# Altium schematic sheet S7CAS-PLEIADES-CARTE-MERE_Pxx_ARBRE_CAP_ARBRE.SchDoc
size Tabloid; SheetNumber: 16; SheetTotal: 18; Sheet_Name: POWER TREE DECOUPLING; Size: 11x17
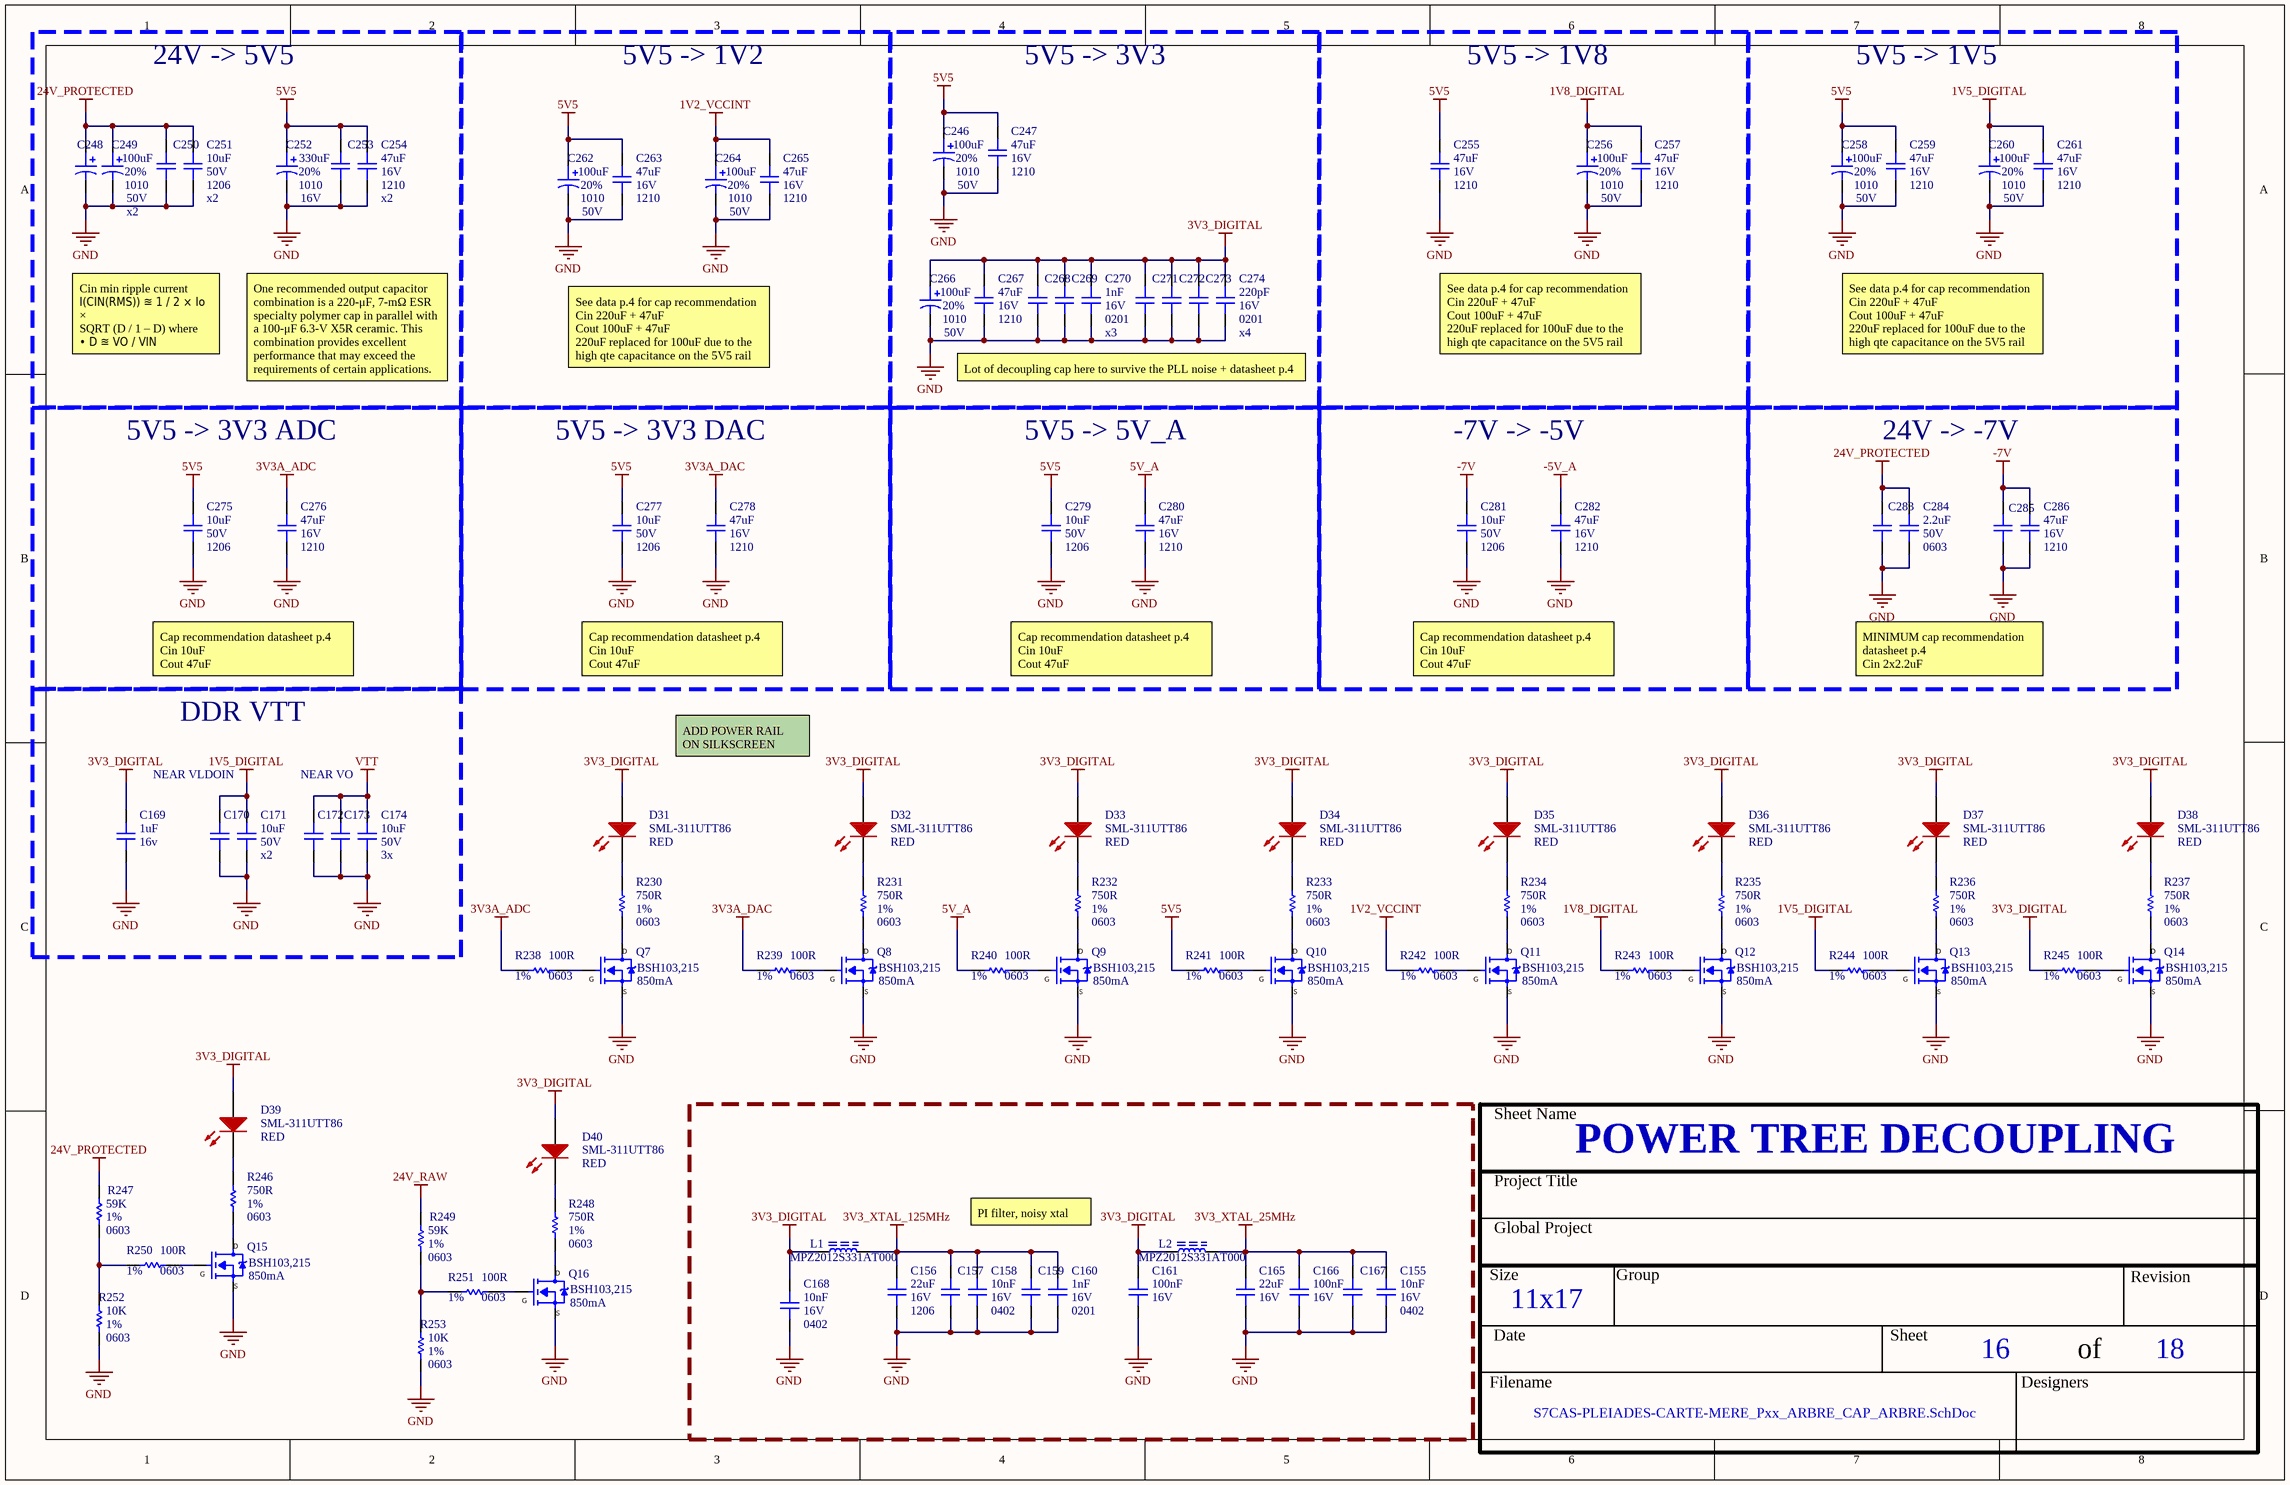
[diagram p0: S7CAS-PLEIADES-CARTE-MERE_Pxx_ARBRE_CAP_ARBRE.SchDoc]

## Parts
C155  value 10nF  Voltage: 16V  Package: 0402  [CAP_0402]  (hidden comment: CAP - 0402)
C156  value 22uF  Voltage: 16V  Package: 1206  [CAP_1206]  (hidden comment: CAP - 1206)
C157  CAP - 0402  [CAP_0402]  (value not drawn)
C158  value 10nF  Voltage: 16V  Package: 0402  [CAP_0402]  (hidden comment: CAP - 0402)
C159  CAP - 0201  [CAP_0201]  (value not drawn)
C160  value 1nF  Voltage: 16V  Package: 0201  [CAP_0201]  (hidden comment: CAP - 0201)
C161  value 100nF  Voltage: 16V  [CAP_0603]  (hidden comment: CAP - 0603)
C165  value 22uF  Voltage: 16V  [CAP_1206]  (hidden comment: CAP - 1206)
C166  value 100nF  Voltage: 16V  [CAP_0603]  (hidden comment: CAP - 0603)
C167  CAP - 0402  [CAP_0402]  (value not drawn)
C168  value 10nF  Voltage: 16V  Package: 0402  [CAP_0402]  (hidden comment: CAP - 0402)
C169  value 1uF  Voltage: 16v  [CAP_0603]  (hidden comment: CAP - 0603)
C170  CAP - 0805  [CAP_0805]  (value not drawn)
C171  value 10uF  Voltage: 50V  [CAP_0805]  (hidden comment: CAP - 0805)
C172  CAP - 0805  [CAP_0805]  (value not drawn)
C173  CAP - 0805  [CAP_0805]  (value not drawn)
C174  value 10uF  Voltage: 50V  [CAP_0805]  (hidden comment: CAP - 0805)
C246  value 100uF  Voltage: 50V  Package: 1010  Precision: 20%  [CAP_ALU_1010_vishay]  (hidden comment: MAL215099101E3)
C247  value 47uF  Voltage: 16V  Package: 1210  [CAP_1210]  (hidden comment: CAP - 1210)
C248  MAL215099101E3  [CAP_ALU_1010_vishay]  (value not drawn)
C249  value 100uF  Voltage: 50V  Package: 1010  Precision: 20%  [CAP_ALU_1010_vishay]  (hidden comment: MAL215099101E3)
C250  CAP - 1206  [CAP_1206]  (value not drawn)
C251  value 10uF  Voltage: 50V  Package: 1206  [CAP_1206]  (hidden comment: CAP - 1206)
C252  value 330uF  Voltage: 16V  Package: 1010  Precision: 20%  [CAP_ALU_1010_vishay]  (hidden comment: MAL214699501E3)
C253  CAP - 1210  [CAP_1210]  (value not drawn)
C254  value 47uF  Voltage: 16V  Package: 1210  [CAP_1210]  (hidden comment: CAP - 1210)
C255  value 47uF  Voltage: 16V  Package: 1210  [CAP_1210]  (hidden comment: CAP - 1210)
C256  value 100uF  Voltage: 50V  Package: 1010  Precision: 20%  [CAP_ALU_1010_vishay]  (hidden comment: MAL215099101E3)
C257  value 47uF  Voltage: 16V  Package: 1210  [CAP_1210]  (hidden comment: CAP - 1210)
C258  value 100uF  Voltage: 50V  Package: 1010  Precision: 20%  [CAP_ALU_1010_vishay]  (hidden comment: MAL215099101E3)
C259  value 47uF  Voltage: 16V  Package: 1210  [CAP_1210]  (hidden comment: CAP - 1210)
C260  value 100uF  Voltage: 50V  Package: 1010  Precision: 20%  [CAP_ALU_1010_vishay]  (hidden comment: MAL215099101E3)
C261  value 47uF  Voltage: 16V  Package: 1210  [CAP_1210]  (hidden comment: CAP - 1210)
C262  value 100uF  Voltage: 50V  Package: 1010  Precision: 20%  [CAP_ALU_1010_vishay]  (hidden comment: MAL215099101E3)
C263  value 47uF  Voltage: 16V  Package: 1210  [CAP_1210]  (hidden comment: CAP - 1210)
C264  value 100uF  Voltage: 50V  Package: 1010  Precision: 20%  [CAP_ALU_1010_vishay]  (hidden comment: MAL215099101E3)
C265  value 47uF  Voltage: 16V  Package: 1210  [CAP_1210]  (hidden comment: CAP - 1210)
C266  value 100uF  Voltage: 50V  Package: 1010  Precision: 20%  [CAP_ALU_1010_vishay]  (hidden comment: MAL215099101E3)
C267  value 47uF  Voltage: 16V  Package: 1210  [CAP_1210]  (hidden comment: CAP - 1210)
C268  CAP - 0201  [CAP_0201]  (value not drawn)
C269  CAP - 0201  [CAP_0201]  (value not drawn)
C270  value 1nF  Voltage: 16V  Package: 0201  [CAP_0201]  (hidden comment: CAP - 0201)
C271  CAP - 0201  [CAP_0201]  (value not drawn)
C272  CAP - 0201  [CAP_0201]  (value not drawn)
C273  CAP - 0201  [CAP_0201]  (value not drawn)
C274  value 220pF  Voltage: 16V  Package: 0201  [CAP_0201]  (hidden comment: CAP - 0201)
C275  value 10uF  Voltage: 50V  Package: 1206  [CAP_1206]  (hidden comment: CAP - 1206)
C276  value 47uF  Voltage: 16V  Package: 1210  [CAP_1210]  (hidden comment: CAP - 1210)
C277  value 10uF  Voltage: 50V  Package: 1206  [CAP_1206]  (hidden comment: CAP - 1206)
C278  value 47uF  Voltage: 16V  Package: 1210  [CAP_1210]  (hidden comment: CAP - 1210)
C279  value 10uF  Voltage: 50V  Package: 1206  [CAP_1206]  (hidden comment: CAP - 1206)
C280  value 47uF  Voltage: 16V  Package: 1210  [CAP_1210]  (hidden comment: CAP - 1210)
C281  value 10uF  Voltage: 50V  Package: 1206  [CAP_1206]  (hidden comment: CAP - 1206)
C282  value 47uF  Voltage: 16V  Package: 1210  [CAP_1210]  (hidden comment: CAP - 1210)
C283  CAP - 0603  [CAP_0603]  (value not drawn)
C284  value 2.2uF  Voltage: 50V  Package: 0603  [CAP_0603]  (hidden comment: CAP - 0603)
C285  CAP - 1210  [CAP_1210]  (value not drawn)
C286  value 47uF  Voltage: 16V  Package: 1210  [CAP_1210]  (hidden comment: CAP - 1210)
D31  SML-311UTT86  value RED  [LED_0603]
D32  SML-311UTT86  value RED  [LED_0603]
D33  SML-311UTT86  value RED  [LED_0603]
D34  SML-311UTT86  value RED  [LED_0603]
D35  SML-311UTT86  value RED  [LED_0603]
D36  SML-311UTT86  value RED  [LED_0603]
D37  SML-311UTT86  value RED  [LED_0603]
D38  SML-311UTT86  value RED  [LED_0603]
D39  SML-311UTT86  value RED  [LED_0603]
D40  SML-311UTT86  value RED  [LED_0603]
L1  Mfg Part Number: MPZ2012S331AT000  [FER_0805]  (hidden comment: FER - 0805)
L2  Mfg Part Number: MPZ2012S331AT000  [FER_0805]  (hidden comment: FER - 0805)
Q7  BSH103,215  Current: 850mA  [SOT23-3]
Q8  BSH103,215  Current: 850mA  [SOT23-3]
Q9  BSH103,215  Current: 850mA  [SOT23-3]
Q10  BSH103,215  Current: 850mA  [SOT23-3]
Q11  BSH103,215  Current: 850mA  [SOT23-3]
Q12  BSH103,215  Current: 850mA  [SOT23-3]
Q13  BSH103,215  Current: 850mA  [SOT23-3]
Q14  BSH103,215  Current: 850mA  [SOT23-3]
Q15  BSH103,215  Current: 850mA  [SOT23-3]
Q16  BSH103,215  Current: 850mA  [SOT23-3]
R230  value 750R  Package: 0603  Precision: 1%  [RES_0603]  (hidden comment: RES - 0603)
R231  value 750R  Package: 0603  Precision: 1%  [RES_0603]  (hidden comment: RES - 0603)
R232  value 750R  Package: 0603  Precision: 1%  [RES_0603]  (hidden comment: RES - 0603)
R233  value 750R  Package: 0603  Precision: 1%  [RES_0603]  (hidden comment: RES - 0603)
R234  value 750R  Package: 0603  Precision: 1%  [RES_0603]  (hidden comment: RES - 0603)
R235  value 750R  Package: 0603  Precision: 1%  [RES_0603]  (hidden comment: RES - 0603)
R236  value 750R  Package: 0603  Precision: 1%  [RES_0603]  (hidden comment: RES - 0603)
R237  value 750R  Package: 0603  Precision: 1%  [RES_0603]  (hidden comment: RES - 0603)
R238  value 100R  Package: 0603  Precision: 1%  [RES_0603]  (hidden comment: RES - 0603)
R239  value 100R  Package: 0603  Precision: 1%  [RES_0603]  (hidden comment: RES - 0603)
R240  value 100R  Package: 0603  Precision: 1%  [RES_0603]  (hidden comment: RES - 0603)
R241  value 100R  Package: 0603  Precision: 1%  [RES_0603]  (hidden comment: RES - 0603)
R242  value 100R  Package: 0603  Precision: 1%  [RES_0603]  (hidden comment: RES - 0603)
R243  value 100R  Package: 0603  Precision: 1%  [RES_0603]  (hidden comment: RES - 0603)
R244  value 100R  Package: 0603  Precision: 1%  [RES_0603]  (hidden comment: RES - 0603)
R245  value 100R  Package: 0603  Precision: 1%  [RES_0603]  (hidden comment: RES - 0603)
R246  value 750R  Package: 0603  Precision: 1%  [RES_0603]  (hidden comment: RES - 0603)
R247  value 59K  Package: 0603  Precision: 1%  [RES_0603]  (hidden comment: RES - 0603)
R248  value 750R  Package: 0603  Precision: 1%  [RES_0603]  (hidden comment: RES - 0603)
R249  value 59K  Package: 0603  Precision: 1%  [RES_0603]  (hidden comment: RES - 0603)
R250  value 100R  Package: 0603  Precision: 1%  [RES_0603]  (hidden comment: RES - 0603)
R251  value 100R  Package: 0603  Precision: 1%  [RES_0603]  (hidden comment: RES - 0603)
R252  value 10K  Package: 0603  Precision: 1%  [RES_0603]  (hidden comment: RES - 0603)
R253  value 10K  Package: 0603  Precision: 1%  [RES_0603]  (hidden comment: RES - 0603)

## Blocks framed on the sheet
24V -> 5V5: C248-C254
5V5 -> 1V2: C262-C265
5V5 -> 3V3: C246 C247 C266-C274
5V5 -> 1V8: C255-C257
5V5 -> 1V5: C258-C261
5V5 -> 3V3 ADC: C275 C276
5V5 -> 3V3 DAC: C277 C278
5V5 -> 5V_A: C279 C280
-7V -> -5V: C281 C282
24V -> -7V: C283-C286
DDR VTT: C169-C174

## Nets
1V2_VCCINT: C264.1 C265.2 R242.2
1V5_DIGITAL: C170.2 C171.2 C260.1 C261.2 R244.2
1V8_DIGITAL: C256.1 C257.2 R243.2
3V3_DIGITAL: C161.2 C168.2 C169.2 C266.1 C267.2 C268.2 C269.2 C270.2 C271.2 C272.2 C273.2 C274.2 D31.A D32.A D33.A D34.A D35.A D36.A D37.A D38.A D39.A D40.A L1.2 L2.2 R245.2
3V3_XTAL_25MHz: C155.2 C165.2 C166.2 C167.2 L2.1
3V3_XTAL_125MHz: C156.2 C157.2 C158.2 C159.2 C160.2 L1.1
3V3A_ADC: C276.2 R238.2
3V3A_DAC: C278.2 R239.2
5V5: C246.1 C247.2 C252.1 C253.2 C254.2 C255.2 C258.1 C259.2 C262.1 C263.2 C275.2 C277.2 C279.2 R241.2
5V_A: C280.2 R240.2
24V_PROTECTED: C248.1 C249.1 C250.2 C251.2 C283.2 C284.2 R247.2
24V_RAW: R249.2
-5V_A: C282.2
-7V: C281.2 C285.2 C286.2
GND: C155.1 C156.1 C157.1 C158.1 C159.1 C160.1 C161.1 C165.1 C166.1 C167.1 C168.1 C169.1 C170.1 C171.1 C172.1 C173.1 C174.1 C246.2 C247.1 C248.2 C249.2 C250.1 C251.1 C252.2 C253.1 C254.1 C255.1 C256.2 C257.1 C258.2 C259.1 C260.2 C261.1 C262.2 C263.1 C264.2 C265.1 C266.2 C267.1 C268.1 C269.1 C270.1 C271.1 C272.1 C273.1 C274.1 C275.1 C276.1 C277.1 C278.1 C279.1 C280.1 C281.1 C282.1 C283.1 C284.1 C285.1 C286.1 Q7.2 Q8.2 Q9.2 Q10.2 Q11.2 Q12.2 Q13.2 Q14.2 Q15.2 Q16.2 R252.1 R253.1
VTT: C172.2 C173.2 C174.2
NetD31_K: D31.K R230.2
NetD32_K: D32.K R231.2
NetD33_K: D33.K R232.2
NetD34_K: D34.K R233.2
NetD35_K: D35.K R234.2
NetD36_K: D36.K R235.2
NetD37_K: D37.K R236.2
NetD38_K: D38.K R237.2
NetD39_K: D39.K R246.2
NetD40_K: D40.K R248.2
NetQ7_1: Q7.1 R238.1
NetQ7_3: Q7.3 R230.1
NetQ8_1: Q8.1 R239.1
NetQ8_3: Q8.3 R231.1
NetQ9_1: Q9.1 R240.1
NetQ9_3: Q9.3 R232.1
NetQ10_1: Q10.1 R241.1
NetQ10_3: Q10.3 R233.1
NetQ11_1: Q11.1 R242.1
NetQ11_3: Q11.3 R234.1
NetQ12_1: Q12.1 R243.1
NetQ12_3: Q12.3 R235.1
NetQ13_1: Q13.1 R244.1
NetQ13_3: Q13.3 R236.1
NetQ14_1: Q14.1 R245.1
NetQ14_3: Q14.3 R237.1
NetQ15_1: Q15.1 R250.1
NetQ15_3: Q15.3 R246.1
NetQ16_1: Q16.1 R251.1
NetQ16_3: Q16.3 R248.1
NetR247_1: R247.1 R250.2 R252.2
NetR249_1: R249.1 R251.2 R253.2

## Notes on the sheet
- x2
- (near C251) x2
- (near C254) x2
- Cin min ripple current
  I(CIN(RMS)) ≊ 1 / 2 × Io ×
  SQRT (D / 1 – D) where
  • D ≊ VO / VIN
  Iripple = 0.55A
- See data p.4 for cap recommendation
  Cin 220uF + 47uF
  Cout 100uF + 47uF
  220uF replaced for 100uF due to the high qte capacitance on the 5V5 rail
- x3
- (near C274) x4
- One recommended output capacitor combination is a 220-μF, 7-mΩ ESR specialty polymer cap in parallel with a 100-μF 6.3-V X5R ceramic. This combination provides excellent performance that may exceed the requirements of certain applications.
- Lot of decoupling cap here to survive the PLL noise + datasheet p.4
- Cap recommendation datasheet p.4
  Cin 10uF
  Cout 47uF
- MINIMUM cap recommendation datasheet p.4
  Cin 2x2.2uF
  Cout 2x47uF
- ADD POWER RAIL
  ON SILKSCREEN
- NEAR VLDOIN
- NEAR VO
- (near C171) x2
- (near C174) 3x
- PI filter, noisy xtal
- Sheet Name
- Project Title
- Global Project
- Size
- Group
- Revision
- Date
- Sheet
- of
- Filename
- Designers
- (in symbol MOS_N_CHANNEL) D; G; S

## Library data of the parts
C155 C158 C168 = CAP - 0402: Precision: 10%; Current: *; CreatedBy: Jonathan Bouchard; Power: *; Supplier 1: Arrow Electronics; Supplier Part Number 1: GRM155R61A224KE19D
C156 C165 C251 C275 C277 C279 C281 = CAP - 1206: Precision: 10%; Current: *; CreatedBy: Jonathan Bouchard; Power: *
  C156: Supplier 1: Arrow Electronics; Supplier Part Number 1: CL31A226MOCLNNC
  C165: Package: 1206; Supplier 1: Arrow Electronics; Supplier Part Number 1: CL31A226MOCLNNC
  C251 C275 C277 C279 C281: Supplier 1: Avnet; Supplier Part Number 1: CL31A106MBHNNNE
C157 C167 = CAP - 0402: Precision: 10%; Voltage: 16V; Value: 10nF; Current: *; CreatedBy: Jonathan Bouchard; Power: *; Package: 0402; Supplier 1: Arrow Electronics; Supplier Part Number 1: GRM155R61A224KE19D
C159 C268 C269 = CAP - 0201: Precision: 10%; Voltage: 16V; Value: 1nF; Current: *; CreatedBy: Jonathan Bouchard; Power: *; Package: 0201; Supplier 1: Avnet; Supplier Part Number 1: GRM033R71C102KA01J
C160 C270 C274 = CAP - 0201: Precision: 10%; Current: *; CreatedBy: Jonathan Bouchard; Power: *
  C160 C270: Supplier 1: Avnet; Supplier Part Number 1: GRM033R71C102KA01J
  C274: Supplier 1: Arrow Electronics; Supplier Part Number 1: GRM033R71C221KA01D
C161 C166 C169 C284 = CAP - 0603: Precision: 10%; Current: *; CreatedBy: Jonathan Bouchard; Power: *; Supplier 1: Arrow Electronics
  C161 C166: Package: 0603; Supplier Part Number 1: CL10B104KO8NNNC
  C169: Package: 0603; Supplier Part Number 1: CL10B105MO8NNWC
  C284: Supplier Part Number 1: GRM188R61H225KE11D
C170 C172 C173 = CAP - 0805: Precision: 10%; Voltage: 50V; Value: 10uF; Current: *; CreatedBy: Jonathan Bouchard; Power: *; Package: 0805; Supplier 1: Avnet; Supplier Part Number 1: CL31A106MBHNNNE
C171 C174 = CAP - 0805: Precision: 10%; Current: *; CreatedBy: Jonathan Bouchard; Power: *; Package: 0805; Supplier 1: Avnet; Supplier Part Number 1: CL31A106MBHNNNE
C246 C248 C249 C256 C258 C260 C262 C264 C266 = CAP_ALU_MAL215099101E3: CAP - ALU 100uF 20% 50V - 1010; Current: 490mA; Mfg: Vishay Dale; Mfg Part Number: MAL215099101E3; HelpURL: http://www.vishay.com/docs/28395/150crz.pdf; CreatedBy: Jonathan Bouchard; Temperature: -55°C to 125°C; Power: *; Supplier 1: Digikey; Supplier Part Number 1: 4399PHDKR-ND
C247 C254 C255 C257 C259 C261 C263 C265 C267 C276 C278 C280 C282 C286 = CAP - 1210: Precision: 10%; Current: *; CreatedBy: Jonathan Bouchard; Power: *; Supplier 1: Arrow Electronics; Supplier Part Number 1: CL32A476KOJNNNE
C250 = CAP - 1206: Precision: 10%; Voltage: 50V; Value: 10uF; Current: *; CreatedBy: Jonathan Bouchard; Power: *; Package: 1206; Supplier 1: Avnet; Supplier Part Number 1: CL31A106MBHNNNE
C252 = CAP_ALU_MAL214699501E3: CAP - ALU 330uF 20% 16V - 1010; Current: 750mA; Mfg: Vishay Dale; Mfg Part Number: MAL214699501E3; HelpURL: http://www.vishay.com/docs/28403/146cti.pdf; CreatedBy: Jonathan Bouchard; Temperature: -55°C to 125°C; Power: *; Supplier 1: Digikey; Supplier Part Number 1: 4405PHCT-ND
C253 C285 = CAP - 1210: Precision: 10%; Voltage: 16V; Value: 47uF; Current: *; CreatedBy: Jonathan Bouchard; Power: *; Package: 1210; Supplier 1: Arrow Electronics; Supplier Part Number 1: CL32A476KOJNNNE
C271-C273 = CAP - 0201: Precision: 10%; Voltage: 16V; Value: 220pF; Current: *; CreatedBy: Jonathan Bouchard; Power: *; Package: 0201; Supplier 1: Arrow Electronics; Supplier Part Number 1: GRM033R71C221KA01D
C283 = CAP - 0603: Precision: 10%; Voltage: 50V; Value: 2.2uF; Current: *; CreatedBy: Jonathan Bouchard; Power: *; Package: 0603; Supplier 1: Arrow Electronics; Supplier Part Number 1: GRM188R61H225KE11D
D31-D40 = LED_SML-311UTT86: LED - 620nM RED 2mA - 0603; Voltage: 1.8V; Mfg: ROHM Semiconductor; Power: 44mW; Current: 2mA; HelpURL: http://media.digikey.com/pdf/Data%20Sheets/Rohm%20PDFs/SML-311%20Series.pdf; CreatedBy: Jonathan Bouchard; Temperature: -30°C to 85°C; Package: 0603; Precision: *; Mfg Part Number: SML-311UTT86; Supplier 1: Digikey; Supplier Part Number 1: 511-1304-1-ND
L1 L2 = FER - 0805: Mfg: TDK Corporation; Current: 2.5A; Value: 50mR@0Hz / 330R@100MHz; Voltage: *; CreatedBy: Jonathan Bouchard; Power: *; Precision: *; Package: 0805; Supplier 1: Arrow Electronics; Supplier Part Number 1: MPZ2012S331AT000
Q7-Q16 = MOS_N_CHANNEL: N-Channel  Enhancement Mode Field Effect Transistor; Mfr: *; Package / Case: *; Vds: *; Rds ON: *; Vgs: *; Operating Temperature: *; Supplier 1: Avnet; Supplier Part Number 1: BSH103,215
R230-R253 = RES - 0603: Current: *; CreatedBy: Jonathan Bouchard; Supplier 1: Arrow Electronics
  R230-R237 R246 R248: Supplier Part Number 1: RMCF0603FT750R
  R238-R245 R250 R251: Supplier Part Number 1: RMCF0603FT100R
  R247 R249: Supplier Part Number 1: RMCF0603FT59K0
  R252 R253: Supplier Part Number 1: RMCF0603FT10K0